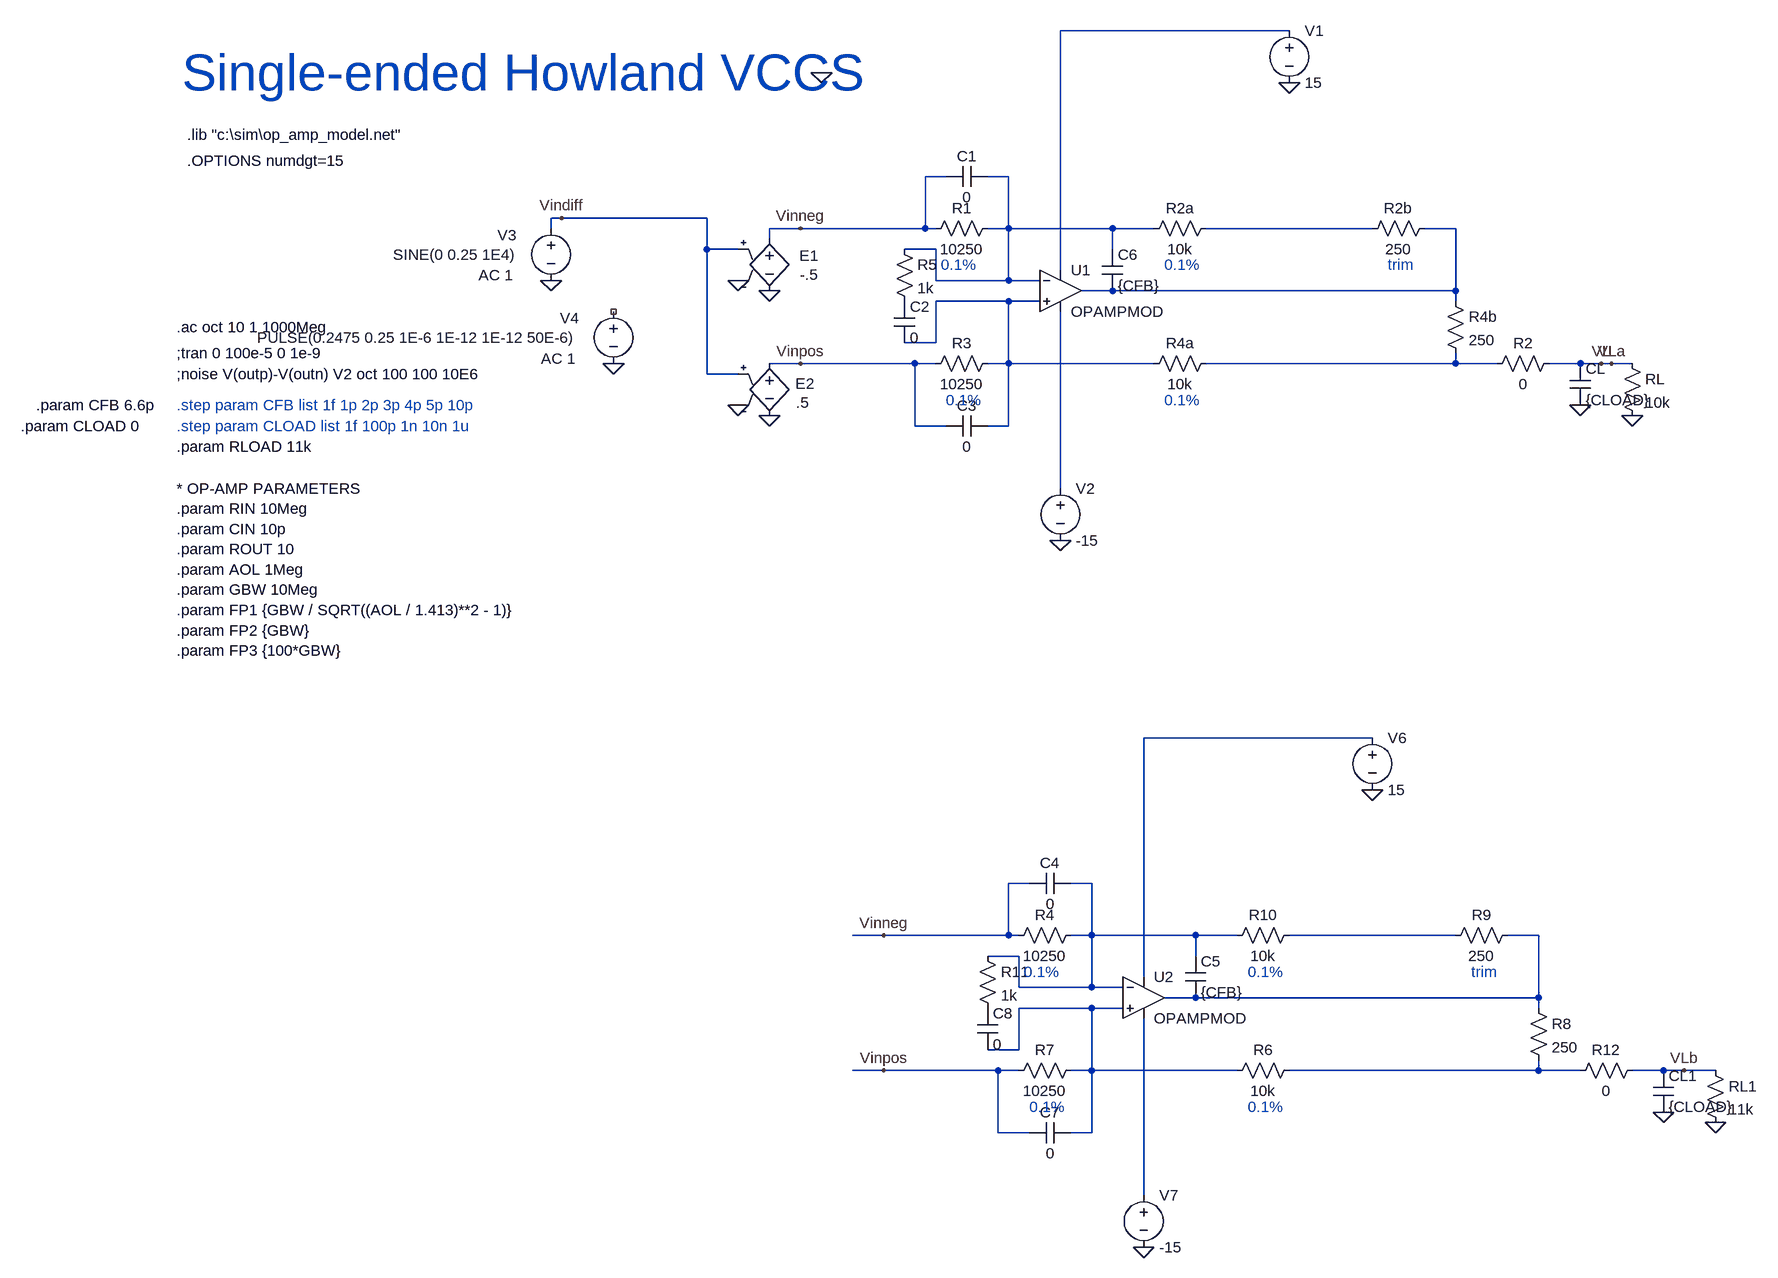
[diagram p0: schematic single_ended_howland.asc]
single_ended_howland.asc, the LTspice schematic file:
Version 4
SHEET 1 4308 2276
WIRE 2656 -656 2304 -656
WIRE 2128 -432 2096 -432
WIRE 2224 -432 2192 -432
WIRE 1536 -368 1520 -368
WIRE 1760 -368 1536 -368
WIRE 1520 -352 1520 -368
WIRE 1904 -352 1856 -352
WIRE 2096 -352 2096 -432
WIRE 2096 -352 1904 -352
WIRE 2112 -352 2096 -352
WIRE 2224 -352 2224 -432
WIRE 2224 -352 2192 -352
WIRE 2384 -352 2224 -352
WIRE 2448 -352 2384 -352
WIRE 2784 -352 2528 -352
WIRE 2912 -352 2864 -352
WIRE 1856 -336 1856 -352
WIRE 1760 -320 1760 -368
WIRE 1808 -320 1760 -320
WIRE 2112 -320 2064 -320
WIRE 2384 -320 2384 -352
WIRE 2304 -288 2304 -656
WIRE 2112 -272 2112 -320
WIRE 2224 -272 2224 -352
WIRE 2224 -272 2112 -272
WIRE 2272 -272 2224 -272
WIRE 2384 -256 2336 -256
WIRE 2912 -256 2912 -352
WIRE 2912 -256 2384 -256
WIRE 2224 -240 2112 -240
WIRE 2272 -240 2224 -240
WIRE 2912 -240 2912 -256
WIRE 2112 -176 2112 -240
WIRE 2112 -176 2064 -176
WIRE 1904 -144 1856 -144
WIRE 2080 -144 1904 -144
WIRE 2112 -144 2080 -144
WIRE 2224 -144 2224 -240
WIRE 2224 -144 2192 -144
WIRE 2448 -144 2224 -144
WIRE 2912 -144 2912 -160
WIRE 2912 -144 2528 -144
WIRE 2976 -144 2912 -144
WIRE 3104 -144 3056 -144
WIRE 3136 -144 3104 -144
WIRE 3152 -144 3136 -144
WIRE 3184 -144 3152 -144
WIRE 1760 -128 1760 -320
WIRE 1808 -128 1760 -128
WIRE 2080 -48 2080 -144
WIRE 2128 -48 2080 -48
WIRE 2224 -48 2224 -144
WIRE 2224 -48 2192 -48
WIRE 2304 48 2304 -224
WIRE 2784 432 2432 432
WIRE 2256 656 2224 656
WIRE 2352 656 2320 656
WIRE 2032 736 1984 736
WIRE 2224 736 2224 656
WIRE 2224 736 2032 736
WIRE 2240 736 2224 736
WIRE 2352 736 2352 656
WIRE 2352 736 2320 736
WIRE 2512 736 2352 736
WIRE 2576 736 2512 736
WIRE 2912 736 2656 736
WIRE 3040 736 2992 736
WIRE 2240 768 2192 768
WIRE 2512 768 2512 736
WIRE 2432 800 2432 432
WIRE 2240 816 2240 768
WIRE 2352 816 2352 736
WIRE 2352 816 2240 816
WIRE 2400 816 2352 816
WIRE 2512 832 2464 832
WIRE 3040 832 3040 736
WIRE 3040 832 2512 832
WIRE 2352 848 2240 848
WIRE 2400 848 2352 848
WIRE 3040 848 3040 832
WIRE 2240 912 2240 848
WIRE 2240 912 2192 912
WIRE 2032 944 1984 944
WIRE 2208 944 2032 944
WIRE 2240 944 2208 944
WIRE 2352 944 2352 848
WIRE 2352 944 2320 944
WIRE 2576 944 2352 944
WIRE 3040 944 3040 928
WIRE 3040 944 2656 944
WIRE 3104 944 3040 944
WIRE 3232 944 3184 944
WIRE 3264 944 3232 944
WIRE 3312 944 3264 944
WIRE 2208 1040 2208 944
WIRE 2256 1040 2208 1040
WIRE 2352 1040 2352 944
WIRE 2352 1040 2320 1040
WIRE 2432 1136 2432 864
FLAG 1520 -272 0
FLAG 1808 -272 0
FLAG 1808 -80 0
FLAG 1904 -144 Vinpos
FLAG 1904 -352 Vinneg
FLAG 1536 -368 Vindiff
FLAG 1856 -256 0
FLAG 1856 -64 0
FLAG 2656 -576 0
FLAG 2304 128 0
FLAG 3136 -144 VL
FLAG 3104 -80 0
FLAG 3184 -64 0
FLAG 1936 -592 0
FLAG 1616 -144 0
FLAG 2032 944 Vinpos
FLAG 2032 736 Vinneg
FLAG 2784 512 0
FLAG 2432 1216 0
FLAG 3232 1008 0
FLAG 3312 1024 0
FLAG 3264 944 VLb
FLAG 3152 -144 VLa
SYMBOL voltage 1520 -368 R0
WINDOW 3 -54 56 Right 2
WINDOW 123 -58 88 Right 2
WINDOW 39 0 0 Left 2
WINDOW 0 -82 26 Left 2
SYMATTR Value SINE(0 0.25 1E4)
SYMATTR Value2 AC 1
SYMATTR InstName V3
SYMBOL e 1856 -352 R0
WINDOW 0 46 42 Left 2
WINDOW 3 47 71 Left 2
SYMATTR InstName E1
SYMATTR Value -.5
SYMBOL e 1856 -160 R0
WINDOW 0 40 47 Left 2
WINDOW 3 41 76 Left 2
SYMATTR InstName E2
SYMATTR Value .5
SYMBOL voltage 2656 -672 R0
WINDOW 123 0 0 Left 2
WINDOW 39 0 0 Left 2
SYMATTR InstName V1
SYMATTR Value 15
SYMBOL res 2208 -368 R90
WINDOW 0 0 56 VBottom 2
WINDOW 3 32 56 VTop 2
SYMATTR InstName R1
SYMATTR Value 10250
SYMBOL res 2544 -160 R90
WINDOW 0 0 56 VBottom 2
WINDOW 3 32 56 VTop 2
SYMATTR InstName R4a
SYMATTR Value 10k
SYMBOL res 2208 -160 R90
WINDOW 0 0 56 VBottom 2
WINDOW 3 32 56 VTop 2
SYMATTR InstName R3
SYMATTR Value 10250
SYMBOL res 2896 -256 R0
SYMATTR InstName R4b
SYMATTR Value 250
SYMBOL res 2880 -368 R90
WINDOW 0 0 56 VBottom 2
WINDOW 3 32 56 VTop 2
SYMATTR InstName R2b
SYMATTR Value 250
SYMBOL res 2544 -368 R90
WINDOW 0 0 56 VBottom 2
WINDOW 3 32 56 VTop 2
SYMATTR InstName R2a
SYMATTR Value 10k
SYMBOL voltage 2304 32 R0
WINDOW 123 0 0 Left 2
WINDOW 39 0 0 Left 2
SYMATTR InstName V2
SYMATTR Value -15
SYMBOL res 3168 -160 R0
SYMATTR InstName RL
SYMATTR Value 10k
SYMBOL cap 3088 -144 R0
SYMATTR InstName CL
SYMATTR Value {CLOAD}
SYMBOL cap 2192 -448 R90
WINDOW 0 0 32 VBottom 2
WINDOW 3 32 32 VTop 2
SYMATTR InstName C1
SYMATTR Value 0
SYMBOL cap 2368 -320 R0
SYMATTR InstName C6
SYMATTR Value {CFB}
SYMBOL Opamps\\opamp2 2304 -320 R0
SYMATTR InstName U1
SYMATTR Value OPAMPMOD
SYMATTR Value2 AV={AOL} RO={ROUT} RIN={RIN} CIN={CIN} FP1={FP1} FP2={FP2} FP3={FP3}
SYMBOL cap 2192 -64 R90
WINDOW 0 0 32 VBottom 2
WINDOW 3 32 32 VTop 2
SYMATTR InstName C3
SYMATTR Value 0
SYMBOL cap 2048 -240 R0
SYMATTR InstName C2
SYMATTR Value 0
SYMBOL res 2048 -336 R0
SYMATTR InstName R5
SYMATTR Value 1k
SYMBOL res 3072 -160 R90
WINDOW 0 0 56 VBottom 2
WINDOW 3 32 56 VTop 2
SYMATTR InstName R2
SYMATTR Value 0
SYMBOL voltage 1616 -240 R0
WINDOW 3 -54 56 Right 2
WINDOW 123 -58 88 Right 2
WINDOW 39 0 0 Left 2
WINDOW 0 -82 26 Left 2
SYMATTR Value PULSE(0.2475 0.25 1E-6 1E-12 1E-12 50E-6)
SYMATTR Value2 AC 1
SYMATTR InstName V4
SYMBOL voltage 2784 416 R0
WINDOW 123 0 0 Left 2
WINDOW 39 0 0 Left 2
SYMATTR InstName V6
SYMATTR Value 15
SYMBOL res 2336 720 R90
WINDOW 0 0 56 VBottom 2
WINDOW 3 32 56 VTop 2
SYMATTR InstName R4
SYMATTR Value 10250
SYMBOL res 2672 928 R90
WINDOW 0 0 56 VBottom 2
WINDOW 3 32 56 VTop 2
SYMATTR InstName R6
SYMATTR Value 10k
SYMBOL res 2336 928 R90
WINDOW 0 0 56 VBottom 2
WINDOW 3 32 56 VTop 2
SYMATTR InstName R7
SYMATTR Value 10250
SYMBOL res 3024 832 R0
SYMATTR InstName R8
SYMATTR Value 250
SYMBOL res 3008 720 R90
WINDOW 0 0 56 VBottom 2
WINDOW 3 32 56 VTop 2
SYMATTR InstName R9
SYMATTR Value 250
SYMBOL res 2672 720 R90
WINDOW 0 0 56 VBottom 2
WINDOW 3 32 56 VTop 2
SYMATTR InstName R10
SYMATTR Value 10k
SYMBOL voltage 2432 1120 R0
WINDOW 123 0 0 Left 2
WINDOW 39 0 0 Left 2
SYMATTR InstName V7
SYMATTR Value -15
SYMBOL res 3296 928 R0
SYMATTR InstName RL1
SYMATTR Value 11k
SYMBOL cap 3216 944 R0
SYMATTR InstName CL1
SYMATTR Value {CLOAD}
SYMBOL cap 2320 640 R90
WINDOW 0 0 32 VBottom 2
WINDOW 3 32 32 VTop 2
SYMATTR InstName C4
SYMATTR Value 0
SYMBOL cap 2496 768 R0
SYMATTR InstName C5
SYMATTR Value {CFB}
SYMBOL Opamps\\opamp2 2432 768 R0
SYMATTR InstName U2
SYMATTR Value OPAMPMOD
SYMATTR Value2 AV={AOL} RO={ROUT} RIN={RIN} CIN={CIN} FP1={FP1} FP2={FP2} FP3={FP3}
SYMBOL cap 2320 1024 R90
WINDOW 0 0 32 VBottom 2
WINDOW 3 32 32 VTop 2
SYMATTR InstName C7
SYMATTR Value 0
SYMBOL cap 2176 848 R0
SYMATTR InstName C8
SYMATTR Value 0
SYMBOL res 2176 752 R0
SYMATTR InstName R11
SYMATTR Value 1k
SYMBOL res 3200 928 R90
WINDOW 0 0 56 VBottom 2
WINDOW 3 32 56 VTop 2
SYMATTR InstName R12
SYMATTR Value 0
TEXT 2120 -296 Left 2 ;0.1%
TEXT 2128 -88 Left 2 ;0.1%
TEXT 2464 -296 Left 2 ;0.1%
TEXT 2464 -88 Left 2 ;0.1%
TEXT 2808 -296 Left 2 ;trim
TEXT 944 -200 Left 2 !.ac oct 10 1 1000Meg
TEXT 944 -160 Left 2 !;tran 0 100e-5 0 1e-9
TEXT 960 -456 Left 2 !.OPTIONS numdgt=15
TEXT 944 -128 Left 2 !;noise V(outp)-V(outn) V2 oct 100 100 10E6
TEXT 944 -80 Left 2 ;.step param CFB list 1f 1p 2p 3p 4p 5p 10p
TEXT 944 48 Left 2 !* OP-AMP PARAMETERS\n.param RIN 10Meg\n.param CIN 10p\n.param ROUT 10\n.param AOL 1Meg\n.param GBW 10Meg\n.param FP1 {GBW / SQRT((AOL / 1.413)**2 - 1)}\n.param FP2 {GBW}\n.param FP3 {100*GBW}
TEXT 960 -496 Left 2 !.lib "c:\\sim\\op_amp_model.net"
TEXT 952 -592 Left 6 ;Single-ended Howland VCCS
TEXT 944 -48 Left 2 ;.step param CLOAD list 1f 100p 1n 10n 1u
TEXT 728 -80 Left 2 !.param CFB 6.6p
TEXT 944 -16 Left 2 !.param RLOAD 11k
TEXT 704 -48 Left 2 !.param CLOAD 0
TEXT 2248 792 Left 2 ;0.1%
TEXT 2256 1000 Left 2 ;0.1%
TEXT 2592 792 Left 2 ;0.1%
TEXT 2592 1000 Left 2 ;0.1%
TEXT 2936 792 Left 2 ;trim

The netlist it stands for:
* single_ended_howland.asc
V3 Vindiff 0 SINE(0 0.25 1E4) AC 1
E1 Vinneg 0 Vindiff 0 -.5
E2 Vinpos 0 Vindiff 0 .5
V1 N001 0 15
R1 N002 Vinneg 10250
R4a N006 N005 10k
R3 N005 Vinpos 10250
R4b N004 N006 250
R2b N004 N003 250
R2a N003 N002 10k
V2 N007 0 -15
RL VLa 0 10k
CL VLa 0 {CLOAD}
C1 N002 Vinneg 0
C6 N002 N004 {CFB}
XU1 N005 N002 N001 N007 N004 OPAMPMOD AV={AOL} RO={ROUT} RIN={RIN} CIN={CIN} FP1={FP1} FP2={FP2} FP3={FP3}  ; pins In+ In- V+ V- OUT
C3 N005 Vinpos 0
C2 P001 N005 0
R5 N002 P001 1k
R2 VLa N006 0
V4 NC_01 0 PULSE(0.2475 0.25 1E-6 1E-12 1E-12 50E-6) AC 1
V6 N008 0 15
R4 N009 Vinneg 10250
R6 N013 N012 10k
R7 N012 Vinpos 10250
R8 N011 N013 250
R9 N011 N010 250
R10 N010 N009 10k
V7 N014 0 -15
RL1 VLb 0 11k
CL1 VLb 0 {CLOAD}
C4 N009 Vinneg 0
C5 N009 N011 {CFB}
XU2 N012 N009 N008 N014 N011 OPAMPMOD AV={AOL} RO={ROUT} RIN={RIN} CIN={CIN} FP1={FP1} FP2={FP2} FP3={FP3}  ; pins In+ In- V+ V- OUT
C7 N012 Vinpos 0
C8 P002 N012 0
R11 N009 P002 1k
R12 VLb N013 0
* 0.1%
* 0.1%
* 0.1%
* 0.1%
* trim
.ac oct 10 1 1000Meg
;tran 0 100e-5 0 1e-9
.OPTIONS numdgt=15
;noise V(outp)-V(outn) V2 oct 100 100 10E6
* .step param CFB list 1f 1p 2p 3p 4p 5p 10p
* OP-AMP PARAMETERS
.param RIN 10Meg
.param CIN 10p
.param ROUT 10
.param AOL 1Meg
.param GBW 10Meg
.param FP1 {GBW / SQRT((AOL / 1.413)**2 - 1)}
.param FP2 {GBW}
.param FP3 {100*GBW}
.lib "c:\sim\op_amp_model.net"
* Single-ended Howland VCCS
* .step param CLOAD list 1f 100p 1n 10n 1u
.param CFB 6.6p
.param RLOAD 11k
.param CLOAD 0
* 0.1%
* 0.1%
* 0.1%
* 0.1%
* trim
.backanno
.end